# EAGLE schematic vader_electrics (EAGLE 9.7.0)
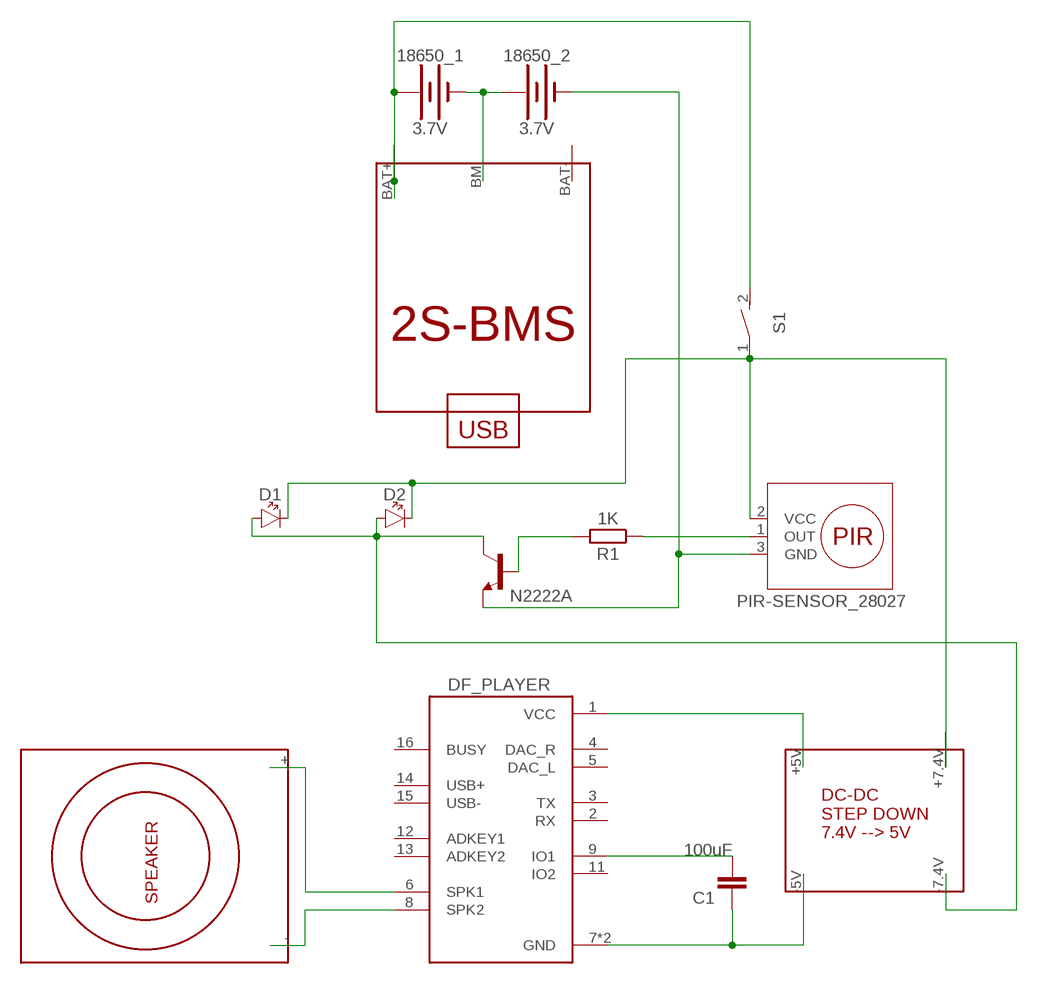
[diagram p0: schematic, sheet 1]

## Parts
18650_1  3.7V  BATTERY-AAA  [BATTERY-AAA]
18650_2  3.7V  BATTERY-AAA  [BATTERY-AAA]
C1  100uF  CAPACITOR-N0402  [0402-CAP]
D1  CHIP-FLAT-R_0603-0.35MM  [LEDC1608X35N_FLAT-R]
D2  CHIP-FLAT-R_0603-0.35MM  [LEDC1608X35N_FLAT-R]
DF_PLAYER  DFR0299  [MODULE_DFR0299]
N2222A  NPN_JAN2N2222A_TO18-EBC  [TO18]
R1  1K  RESISTOR__CHIP-0402(1005-METRIC)  [RESC1005X40]
S1  DS01E  [DS-01]
U$1  2S-BMS2S-BMS  [2S-BMS]
U$2  PIR-SENSOR_28027  [28027]
U$3  SPEAKERSPEAKER  [SPEAKER]
U$4  STEP_DOWN_CONVERTERSTEP_DOWN_CONVERTER  [STEP_DOWN_CONVERTER]

## Nets
N$1: 18650_1.GND@1(-) 18650_2.PWR@1(+) U$1.BM
N$2: D1.A D2.A N2222A.3(C) U$4.-7.4V
N$3: 18650_1.PWR@1(+) S1.2 U$1.BAT+(BAT_+)
N$4: 18650_2.GND@1(-) N2222A.1(E) U$2.3(GND)
N$5: DF_PLAYER.1(VCC) U$4.+5V
N$6: C1.1 DF_PLAYER.7(GND) DF_PLAYER.10(GND) U$4.-5V
N$7: C1.2 DF_PLAYER.9(IO1)
N$8: DF_PLAYER.6(SPK1) U$3.+
N$9: DF_PLAYER.8(SPK2) U$3.-
N$10: N2222A.2(B) R1.2
N$11: R1.1 U$2.1(OUT)
N$13: D1.C D2.C S1.1 U$2.2(VCC) U$4.+7.4V
Unconnected: DF_PLAYER.2(RX) DF_PLAYER.3(TX) DF_PLAYER.4(DAC_R) DF_PLAYER.5(DAC_L) DF_PLAYER.11(IO2) DF_PLAYER.12(ADKEY1) DF_PLAYER.13(ADKEY2) DF_PLAYER.14(USB+) DF_PLAYER.15(USB-) DF_PLAYER.16(BUSY) U$1.BAT-(BAT_-)

## Library data of the parts
18650_1 18650_2 = SparkFun-Batteries:BATTERY: Battery - Single Cell A variety of battery chemistries, sizes, and footprints. Device List: 20MM_PTH - Coin Cell Battery Holder - 20mm (PTH) <https://www.sparkfun.com/products/783> 20MM_PTH_KIT- Coin Cell battery Holder - 20 mm (PTH) <http://www.sparkfun.com/products/783>kit version with special mask 6.8MM_PTH - Coin Cell Battery Holder - 6.8MM(SMD) <https://www.digikey.com/product-detail/en/seiko-instruments/MS621FE-FL11E/728-1057-ND/1889208?WT.srch=1&gclid=CNOQ5a6LzdQCFZS2wAodXCkE0g> 12MM_SMD - Coin Cell Battery Holder - 12mm (SMD) <https://www.sparkfun.com/products/10592> 12MM_PTH - Coin Cell Battery Holder - 12mm (PTH) <https://www.sparkfun.com/products/7948> 20MM_SMD - 20mm Coin Cell Battery Holder (SMD) (2 legs) Used on the Big Time Watch Kit <https://www.sparkfun.com/products/11734> 20MM_SMD_4LEGS - Coin Cell Battery Holder - 20mm (SMD) <https://www.sparkfun.com/products/11892> 20MM_SMD_4LEGS_OVERPASTE - Coin Cell Battery Holder - 20mm (SMD) <https://www.sparkfun.com/products/11892> (Over-paste on the legs) 24.5MM_PTH - Coin Cell Battery Holder - 24.5mm (PTH) <https://www.sparkfun.com/products/8863> 9V - 9V Battery Holder - PC Mount Used on the SparkFun SparkPunk Sound Kit <https://www.sparkfun.com/products/11177> and SparkFun SparkPunk Sequencer Kit <https://www.sparkfun.com/products/12707> 18650 - Battery Holder - 18650 (PTH) <https://www.sparkfun.com/products/13113> AA - Battery Holder - 1xAA (PTH) <https://www.sparkfun.com/products/7949> AAA - Battery Holder - 1xAAA (PTH) <https://www.sparkfun.com/products/12718> AA_KIT - Battery Holder - 1xAA (PTH) <https://www.sparkfun.com/products/7949> Special kit package - pads only have exposed copper on one side of the board. AAA_KIT - Battery Holder - 1xAAA (PTH) <https://www.sparkfun.com/products/12718> Special kit package - pads only have exposed copper on one side of the board.
C1 = Airquality_Sensor:CAPACITOR-N
D1 D2 = LED:CHIP-FLAT-R: Red LED - Generic
DF_PLAYER = DFR0299:DFR0299: Check availability <https://pricing.snapeda.com/parts/DFR0299/DFRobot/view-part?ref=eda>
N2222A = Transistor:NPN_: NPN Transistor - Popular parts
R1 = Tinkercad:RESISTOR: Resistor Fixed - Generic
S1 = Switch:DS01E: DIL/CODE Switch
U$1 = 2S_BMS:2S-BMS
U$2 = Tinkercad:PIR-SENSOR
U$3 = 2S_BMS:SPEAKER
U$4 = 2S_BMS:STEP_DOWN_CONVERTER